# Altium project wacky-racer-hat.PrjPcb
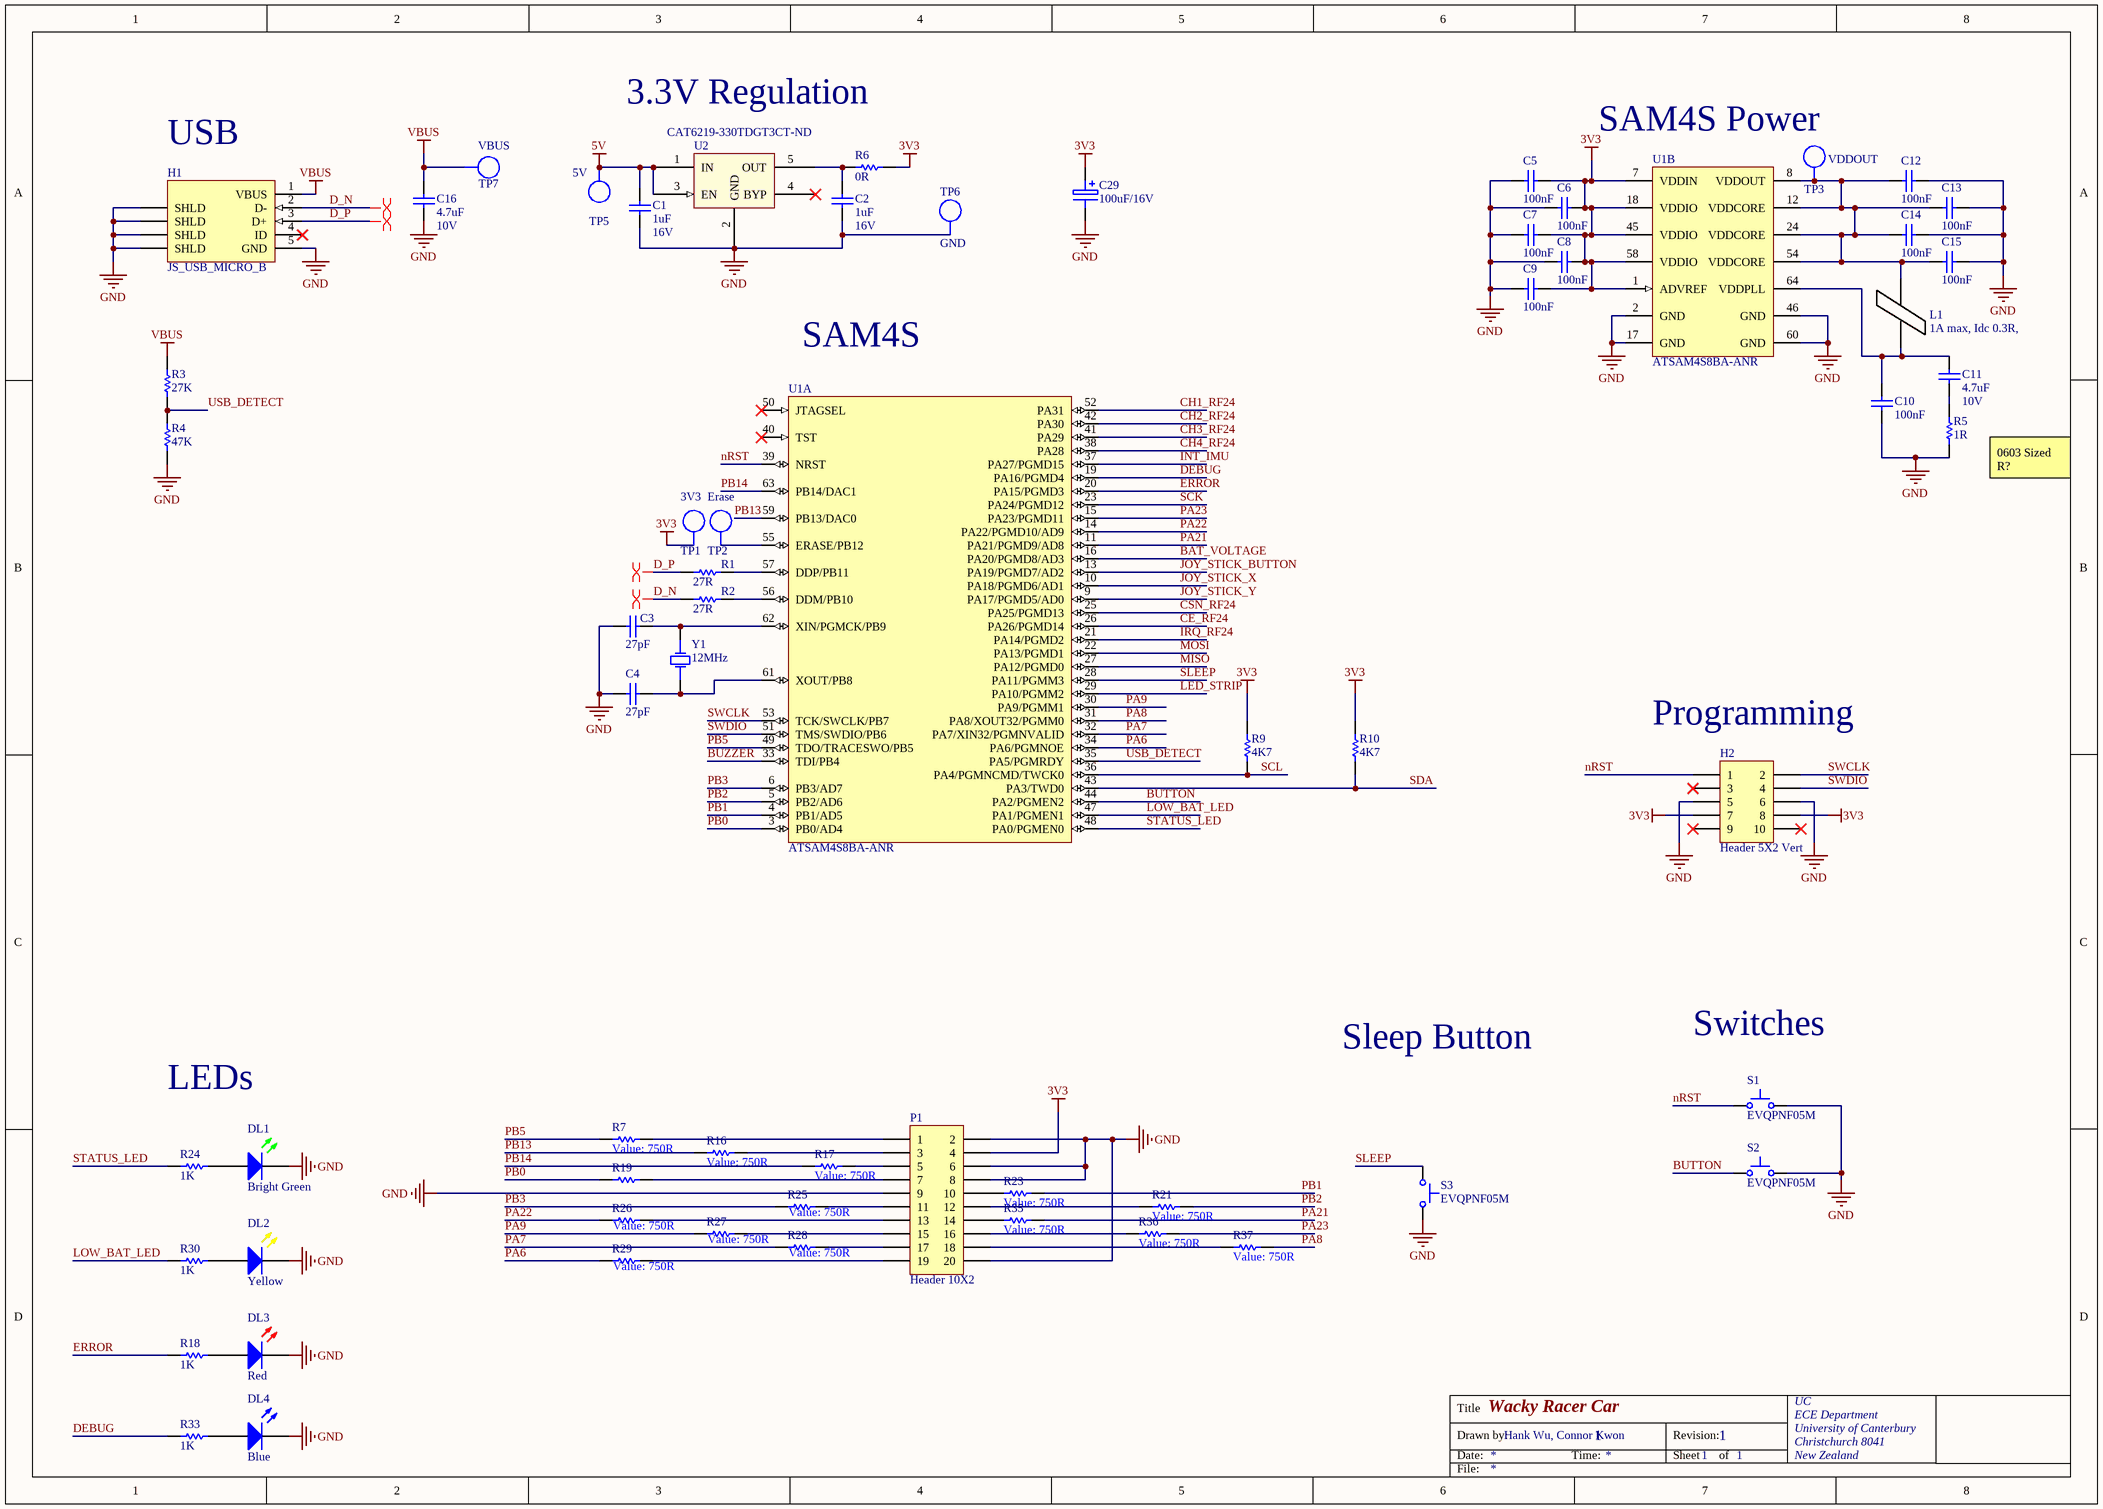
[diagram p0: MCU.SchDoc]
6 sheets, 109 parts. Net scope: global (net labels, ports and power ports of the same name join across sheets).
Board file: hat_template 2021V3.PcbDoc
Sheets:
  MCU.SchDoc
  Power.SchDoc
  IMU.SchDoc
  Radio.SchDoc
  buzzer.SchDoc
  joystick.SchDoc

## Sheet MCU.SchDoc: Wacky Racer Car
size A3; DrawnBy: Hank Wu, Connor Kwon; Organization: UC; Address1: ECE Department; Address2: University of Canterbury; Address3: Christchurch 8041; Address4: New Zealand; DocumentNumber: 1; Revision: 1; SheetNumber: 1; SheetTotal: 1

### Parts
C1  Max Voltage: 16V  [CAPC1608L]  (hidden comment: 1uF)
C2  Max Voltage: 16V  [CAPC1608L]  (hidden comment: 1uF)
C3  27pF  [CAPC1608L]
C4  27pF  [CAPC1608L]
C5  100nF  [CAPC1608L]
C6  100nF  [CAPC1608L]
C7  100nF  [CAPC1608L]
C8  100nF  [CAPC1608L]
C9  100nF  [CAPC1608L]
C10  100nF  [CAPC1608L]
C11  Max Voltage: 10V  [CAPC1608N]  (hidden comment: 4.7uF)
C12  100nF  [CAPC1608L]
C13  100nF  [CAPC1608L]
C14  100nF  [CAPC1608L]
C15  100nF  [CAPC1608L]
C16  Max Voltage: 10V  [CAPC1608N]  (hidden comment: 4.7uF)
C29  100uF/16V  [NICH-1]
DL1  Bright Green  [WL-SMCW0603]
DL2  Yellow  [WL-SMCW0603]
DL3  Red  [WL-SMCW0603]
DL4  Blue  [WL-SMCW0603]
H1  JS_USB_MICRO_B  [FCI_USB_10118194-0001LF]
H2  Header 5X2 Vert  [IDC2.54-V10D]
L1  1A max, Idc 0.3R,  [INDC3216L]
P1  Header 10X2  [HDR2X10]
R1  27R  [RESC1608L]
R2  27R  [RESC1608L]
R3  27K  [RESC1608L]
R4  47K  [RESC1608L]
R5  1R  [RESC3216L]
R6  0R  [RESC1608L]
R7  750R  [RESC1608L]
R9  4K7  [RESC1608L]
R10  4K7  [RESC1608L]
R16  750R  [RESC1608L]
R17  750R  [RESC1608L]
R18  1K  [RESC1608L]
R19  (no value)  [RESC1608L]
R21  750R  [RESC1608L]
R23  750R  [RESC1608L]
R24  1K  [RESC1608L]
R25  750R  [RESC1608L]
R26  750R  [RESC1608L]
R27  750R  [RESC1608L]
R28  750R  [RESC1608L]
R29  750R  [RESC1608L]
R30  1K  [RESC1608L]
R33  1K  [RESC1608L]
R35  750R  [RESC1608L]
R36  750R  [RESC1608L]
R37  750R  [RESC1608L]
S1  EVQPNF05M  [EVQPNF05M]
S2  EVQPNF05M  [EVQPNF05M]
S3  EVQPNF05M  [EVQPNF05M]
TP1  3V3  [TP_1206]  (no BOM)
TP2  Erase  [TP_1206]  (no BOM)
TP3  VDDOUT  [TP_1206]  (no BOM)
TP5  5V  [TP_1206]  (no BOM)
TP6  GND  [TP_1206]  (no BOM)
TP7  VBUS  [TP_1206]  (no BOM)
U1  ATSAM4S8BA-ANR  [LQFP64_L]  (parts A,B of 2)
U2  Supplier Part Number: CAT6219-330TDGT3CT-ND  [SOT95P280X145-5N]  (hidden comment: CAT6219-330TDGT3)
Y1  12MHz  [6.0X3.5-4]

### Nets
3V3: C5.2 C6.2 C7.2 C8.2 C9.2 C29.2 H2.7 H2.8 P1.4 R6.2 R9.2 R10.2 TP1.1 U1.1(ADVREF) U1.7(VDDIN) U1.18(VDDIO) U1.45(VDDIO) U1.58(VDDIO)
5V: C1.2 TP5.1 U2.1(IN) U2.3(EN)
GND: C1.1 C2.1 C3.1 C4.1 C5.1 C6.1 C7.1 C8.1 C9.1 C10.1 C12.2 C13.2 C14.2 C15.2 C16.1 C29.1 DL1.1(K) DL2.1(K) DL3.1(K) DL4.1(K) H1.5(GND) H1.6(SHLD) H2.5 H2.6 P1.2 P1.6 P1.8 P1.9 P1.20 R4.1 R5.1 S1.2 S2.2 S3.2 TP6.1 U1.2(GND) U1.17(GND) U1.46(GND) U1.60(GND) U2.2(GND)
VBUS: C16.2 H1.1(VBUS) R3.2 TP7.1
BAT_VOLTAGE: U1.16(PA20/PGMD8/AD3)
BUTTON: S2.1 U1.44(PA2/PGMEN2)
BUZZER: U1.33(TDI/PB4)
CE_RF24: U1.26(PA26/PGMD14)
CH1_RF24: U1.52(PA31)
CH2_RF24: U1.42(PA30)
CH3_RF24: U1.41(PA29)
CH4_RF24: U1.38(PA28)
CSN_RF24: U1.25(PA25/PGMD13)
D_N: H1.2(D-) R2.1
D_P: H1.3(D+) R1.1
DEBUG: R33.1 U1.19(PA16/PGMD4)
ERROR: R18.1 U1.20(PA15/PGMD3)
INT_IMU: U1.37(PA27/PGMD15)
IRQ_RF24: U1.21(PA14/PGMD2)
JOY_STICK_BUTTON: U1.13(PA19/PGMD7/AD2)
JOY_STICK_X: U1.10(PA18/PGMD6/AD1)
JOY_STICK_Y: U1.9(PA17/PGMD5/AD0)
LED_STRIP: U1.29(PA10/PGMM2)
LOW_BAT_LED: R30.1 U1.47(PA1/PGMEN1)
MISO: U1.27(PA12/PGMD0)
MOSI: U1.22(PA13/PGMD1)
nRST: H2.1 S1.1 U1.39(NRST)
PA6: R29.1 U1.34(PA6/PGMNOE)
PA7: R28.1 U1.32(PA7/XIN32/PGMNVALID)
PA8: R37.2 U1.31(PA8/XOUT32/PGMM0)
PA9: R27.1 U1.30(PA9/PGMM1)
PA21: R35.2 U1.11(PA21/PGMD9/AD8)
PA22: R26.1 U1.14(PA22/PGMD10/AD9)
PA23: R36.2 U1.15(PA23/PGMD11)
PB0: R19.1 U1.3(PB0/AD4)
PB1: R23.2 U1.4(PB1/AD5)
PB2: R21.2 U1.5(PB2/AD6)
PB3: R25.1 U1.6(PB3/AD7)
PB5: R7.1 U1.49(TDO/TRACESWO/PB5)
PB13: R16.1 U1.59(PB13/DAC0)
PB14: R17.1 U1.63(PB14/DAC1)
SCK: U1.23(PA24/PGMD12)
SCL: R9.1 U1.36(PA4/PGMNCMD/TWCK0)
SDA: R10.1 U1.43(PA3/TWD0)
SLEEP: S3.1 U1.28(PA11/PGMM3)
STATUS_LED: R24.1 U1.48(PA0/PGMEN0)
SWCLK: H2.2 U1.53(TCK/SWCLK/PB7)
SWDIO: H2.4 U1.51(TMS/SWDIO/PB6)
USB_DETECT: R3.1 R4.2 U1.35(PA5/PGMRDY)
NetC2_2: C2.2 R6.1 U2.5(OUT)
NetC3_2: C3.2 U1.62(XIN/PGMCK/PB9) Y1.3(OSC2)
NetC4_2: C4.2 U1.61(XOUT/PB8) Y1.1(OSC1)
NetC10_2: C10.2 C11.2 L1.1 U1.64(VDDPLL)
NetC11_1: C11.1 R5.2
NetC12_1: C12.1 C13.1 C14.1 C15.1 L1.2 TP3.1 U1.8(VDDOUT) U1.12(VDDCORE) U1.24(VDDCORE) U1.54(VDDCORE)
NetDL1_2: DL1.2(A) R24.2
NetDL2_2: DL2.2(A) R30.2
NetDL3_2: DL3.2(A) R18.2
NetDL4_2: DL4.2(A) R33.2
NetP1_1: P1.1 R7.2
NetP1_3: P1.3 R16.2
NetP1_5: P1.5 R17.2
NetP1_7: P1.7 R19.2
NetP1_10: P1.10 R23.1
NetP1_11: P1.11 R25.2
NetP1_12: P1.12 R21.1
NetP1_13: P1.13 R26.2
NetP1_14: P1.14 R35.1
NetP1_15: P1.15 R27.2
NetP1_16: P1.16 R36.1
NetP1_17: P1.17 R28.2
NetP1_18: P1.18 R37.1
NetP1_19: P1.19 R29.2
NetR1_2: R1.2 U1.57(DDP/PB11)
NetR2_2: R2.2 U1.56(DDM/PB10)
NetTP2_1: TP2.1 U1.55(ERASE/PB12)

Not connected (* = marked no-connect by the designer): H1 4(ID)*; H2 3* 9* 10*; U1 40(TST)* 50(JTAGSEL)*; U2 4(BYP)*

### Layout directives
differential pair: D_N, D_P

### Notes on the sheet
- 3.3V Regulation
- (near H1) USB
- SAM4S Power
- SAM4S
- (near R5) 0603 Sized R?
- (near H2) Programming
- Sleep Button
- Switches
- LEDs
- Title
- Drawn by:
- Date:
- Time:
- Revision:
- Sheet
- of
- File:

### Library data of the parts
C1 C2 = CC_1uF_0603: CAP CER 1uF Y5V -20% +80% 16V 0603; PackageReference: 0603; Code_IPC: 1608 [0603]; Verify: *; Supplier: ECE Dept; Storage Location: PCB Assembly WS; Value: 1uF
C3 C4 = CC_27pF_0603: CAP CER 27pF NPO/COG +-5% 50V 0603; PackageReference: 0603; Code_IPC: 1608 [0603]; Verify: *; Supplier: ECE Dept; Storage Location: PCB Assembly WS; Value: 27pF
C5-C10 C12-C15 = CC_100nF_0603: CAP CER 100nF X7R +-10% 50V 0603; PackageReference: 0603; Code_IPC: 1608 [0603]; Verify: *; Supplier: ECE Dept; Storage Location: PCB Assembly WS; Value: 100nF
C11 C16 = CC_4.7uF_0603: CAP CER 4.7uF X5R +-20%  10V 0603; Note: Footprint corresponds to dimensions for bulk cassette packaging. This case size has tightened tolerances.; PackageReference: 0805; Code_IPC: 2012[0805]; Verify: *; Supplier: ECE Dept; Storage Location: PCB Assembly WS; Value: 4.7uF
C29 = CA_100uF_16V: CAP ALUM 100uF 16V SMD; Manufacturer PN: UWX1C101MCL1GB; Manufacturer: Nichcon; Supplier 1: Farnell; Supplier Part Number 1: 1870677; Storage Location: PCB Assembly WS; Supplier: ECE Dept; Supplier 2: Digi-Key; Supplier Part Number 2: 493-2105-1-ND; Value: 100uF/16V
DL1 = DL_150060VS75000: LED Bright Green 40mcd 0603 SMD; Manufacturer: WURTH ELEKTRONIK; Forward Current If: 30; Forward Voltage: 2; Viewing Angle: 140°; Wavelength Typ: 570; Luminous Intensity: 40; LED Mounting: SMD; Supplier 1: Farnell; Supplier Part Number 1: 2322073; Manufacturer Part Number: 150060VS75000; Storage Location: PCB Assembly WS; Supplier: ECE Dept; LED Colour: Bright Green
DL2 = DL_150060YS75000: LED Yellow 120mcd 0603 SMD; Manufacturer: WURTH ELEKTRONIK; Forward Current If: 30; Forward Voltage: 2; Wavelength Typ: 590; Lens Shape: Rectangular; Viewing Angle: 140°; Luminous Intensity: 120; LED Mounting: SMD; Supplier 1: Farnell; Supplier Part Number 1: 2322074; Manufacturer Part Number: 150060YS75000; Storage Location: PCB Assembly WS; Supplier: ECE Dept; LED Colour: Yellow
DL3 = DL_150060RS75000: LED Red 250mcd 0603 SMD; Manufacturer: WURTH ELEKTRONIK; Forward Current If: 30; Forward Voltage: 2; Lens Shape: Rectangular; Luminous Intensity: 250; Wavelength Typ: 625; Viewing Angle: 140°; LED Mounting: SMD; Supplier 1: Farnell; Supplier Part Number 1: 2322071; Manufacturer Part Number: 150060RS75000; Storage Location: PCB Assembly WS; Supplier: ECE Dept; LED Colour: Red
DL4 = DL_150060BS75000: LED Blue 270mcd 0603 SMD; Manufacturer: WURTH ELEKTRONIK; Forward Current If: 30; Forward Voltage: 3.2; Luminous Intensity: 270; Viewing Angle: 120°; Wavelength Typ: 470; Pricing: 1=0.3844, 50=0.3252, 100=0.2957, 500=0.2365 (NZD); Supplier 1: Farnell; Supplier Part Number 1: 2322069; Manufacturer Part Number: 150060BS75000; Storage Location: PCB Assembly WS; Supplier: ECE Dept; LED Colour: Blue
H1 = JS_USB_MICRO_B_SMT: CONN USB MICRO B RECPT SMT R/A; Manufacturer: FCI; Manufacturer Part Number: 10118194-0001LF; Gender: Receptacle; Number of Contacts: 5; Specifications: USB 2.0; Supplier 1: Digi-Key; Supplier Part Number 1: 609-4618-1-ND; Features: Shielded, Solder Retention; Mounting Type: Surface Mount, Right Angle, Horizontal
H2 = JA_HDR_IDC_5X2_VERT: IDC Header, 2,54mm, 10-Pin, Vert; Supplier: ECE Dept; Supplier 1: Farnell; Supplier Part Number 1: 1096985; Storage Location: ECE Dept Store
L1 = IN_Ferrite-Bead: Ferrite Bead, Rdc 0.3R, Z100MHZ 600R, Imax 1A, SMD 1206; Manufacturer: FAIR-RITE; Manufacturer PN: 2512066017Y1; DC Current Rating: 1; DC Resistance Max: 0.08; Ferrite Case Style: 1206 ^3216 Metric]; Frequency Range: 50MHz to 1; Impedance: 600; Impedance Tolerance: ± 25%; Supplier: ECE Dept; Storage Location: PCB Assembly WS; Ferrite Mounting: SMD; Supplier 1: Farnell; Supplier Part Number 1: 1612060; Manufacturer Part Number: 2512066017Y1; Value: 1A max, Idc 0.3R,
P1 = Header 10X2: Header, 10-Pin, Dual row; LatestRevisionDate: 17-Jul-2002; LatestRevisionNote: Re-released for DXP Platform.; Publisher: Altium Limited
R1 R2 = RS_27R: RES 27 OHM 1/10W 5% 0603 SMD; Storage Location: PCB Assembly WS; Supplier: ECE Dept; Value: 27R
R3 R4 = RS_27K: RES 27K OHM 1/10W 5% 0603 SMD; Storage Location: PCB Assembly WS; Supplier: ECE Dept
  R3: Value: 27K
  R4: Value: 47K
R5 = RT_1R: RES 1R OHM 1/4W 5% 1206 SMD; Storage Location: PCB Assembly WS; Supplier: ECE Dept; Value: 1R
R6 = RS_0R0: RES 0.0 OHM 1/10W 5% 0603 SMD; Storage Location: PCB Assembly WS; Supplier: ECE Dept; Value: 0R
R7 R16 R17 R19 R21 R23 R25-R29 R35-R37 = RS_750R: RES 750 OHM 1/10W 5% 0603 SMD; Storage Location: PCB Assembly WS; Supplier: ECE Dept
  R7 R16 R17 R21 R23 R25-R29 R35-R37: Value: 750R
R9 R10 = RS_4K7: RES 4.7K OHM 1/10W 5% 0603 SMD; Storage Location: PCB Assembly WS; Supplier: ECE Dept; Value: 4K7
R18 R24 R30 R33 = RS_1K: RES 1.0K OHM 1/10W 5% 0603 SMD; Storage Location: PCB Assembly WS; Supplier: ECE Dept; Value: 1K
S1-S3 = WS_EVQPNF05M: Panasonic 6 x 3.5mm SMD Light Touch Switch Type SMD; PackageDescription: 6.0 x 3.5 mm; Supplier 1: Farnell; Supplier Part Number 1: 2079481; Manufacturer: Panasonic; Manufacturer PN: EVQPNF05M; Supplier 2: Digi-Key; Supplier Part Number 2: P13598SCT-ND; Storage Location: PCB Assembly WS; Supplier: ECE Dept
TP1-TP3 TP5-TP7 = TP_1206: Test-Point 3.3x1.6x2.1mm SMD; Manufacturer: Harwin Inc; Manufacturer Part Number: S1751-46R; Value: TP; Manufacturer PN: *; Storage Location: ProtoPlace; Mounting Type: Surface Mount; Type: PC Test Point; Supplier 1: Digi-Key; Supplier Part Number 1: 952-1478-2-ND; Supplier 2: Farnell; Supplier Part Number 2: 1826282; Supplier: ECE Dept
U1 = SE_ATSAM4S16BA-MU: IC MCU 32BIT 512KB FLASH 64LQFP; Manufacturer: Atmel; Connectivity: I²C, IrDA, Memory Card, SPI, SSC, UART/USART, USB; Core Processor: ARM® Cortex®-M4; Core Size: 32-Bit; Data Converters: A/D 11x12b, D/A 2x12b; Number of I/O: 47; Peripherals: Brown-out Detect/Reset, DMA, POR, PWM, WDT; Program Memory Size: 512KB (512K x 8); RAM Size: 128K x 8; Speed: 120MHz; Voltage - Supply (Vcc/Vdd): 1.62 V ~ 3.6 V; PackageVersion: revJ, Jul-2007; PackageReference: 64PS; PackageDescription: 64-Pin Quad Flat No-Lead (QFN) Sawn, 9 x 9 x 1.0 mm Body, 0.5 mm Pitch, Exposed Pad; Code_JEDEC: MO-220VMMD-3; ComponentLink1Description: Manufacturer URL; ComponentLink1URL: http://www.atmel.com/; ComponentLink2Description: SAM4S Series Datasheet; ComponentLink2URL: http://www.atmel.com/dyn/resources/prod_documents/11100.pdf; ComponentLink3Description: SAM4S Series Summary; ComponentLink3URL: http://www.atmel.com/dyn/resources/prod_documents/11100S.pdf; Supplier 1: Digi-Key; Package / Case: 64-LQFP; Packaging: Cut Tape (CT); Program Memory Type: FLASH; Supplier Part Number 1: ATSAM4S8BA-ANRCT-ND; Manufacturer Part Number: ATSAM4S8BA-ANR
U2 = SV_CAT6219-330TDGT3: IC REG LIN 3.3V 500MA TSOT23-5; Voltage - Input (Max): 5.5V; Voltage Dropout (Max): 0.5V @ 500mA; Manufacturer Part Number: CAT6219-330TDGT3; Base Part Number: CAT6219; Current - Output: 500mA; Package / Case: SOT-23-5 Thin, TSOT-23-5; Supplier: Digi-Key; Supplier Device Package: TSOT-23-5; Voltage - Output (Min/Fixed): 3.3V; ComponentLink1URL: http://www.onsemi.com/pub/Collateral/CAT6219-D.PDF; ComponentLink1Description: http://www.onsemi.com/pub/Collateral/CAT6219-D.PDF; Supplier 1: Digi-Key
Y1 = XT_CRYSTAL_12MHz_18pF: CRYSTAL 12MHZ 18PF 6X3.5mm SMD; Manufacturer: CTS-Frequency Controls; Manufacturer Part Number: 406C35D12M00000; ESR (Equivalent Series Resistance): 60 Ohm; Frequency Stability: ±50ppm; Frequency Tolerance: ±30ppm; Operating Mode: Fundamental; Supplier 1: Digi-Key; Height: 0.047" (1.20mm); Load Capacitance: 18pF; Mounting Type: Surface Mount; Operating Temperature: -20°C ~ 70°C; Package / Case: 4-SMD, No Lead (DFN, LCC); Size / Dimension: 0.236" L x 0.138" W (6.00mm x 3.50mm); Supplier Part Number 1: CTX855CT-ND; Frequency: 12MHz

## Sheet Power.SchDoc: Power
size A3; DrawnBy: Hank Wu, Connor Kwon; Address1: ECE Department; Address2: University of Canterbury; Address3: Christchurch 8041; Address4: New Zealand; Revision: 1
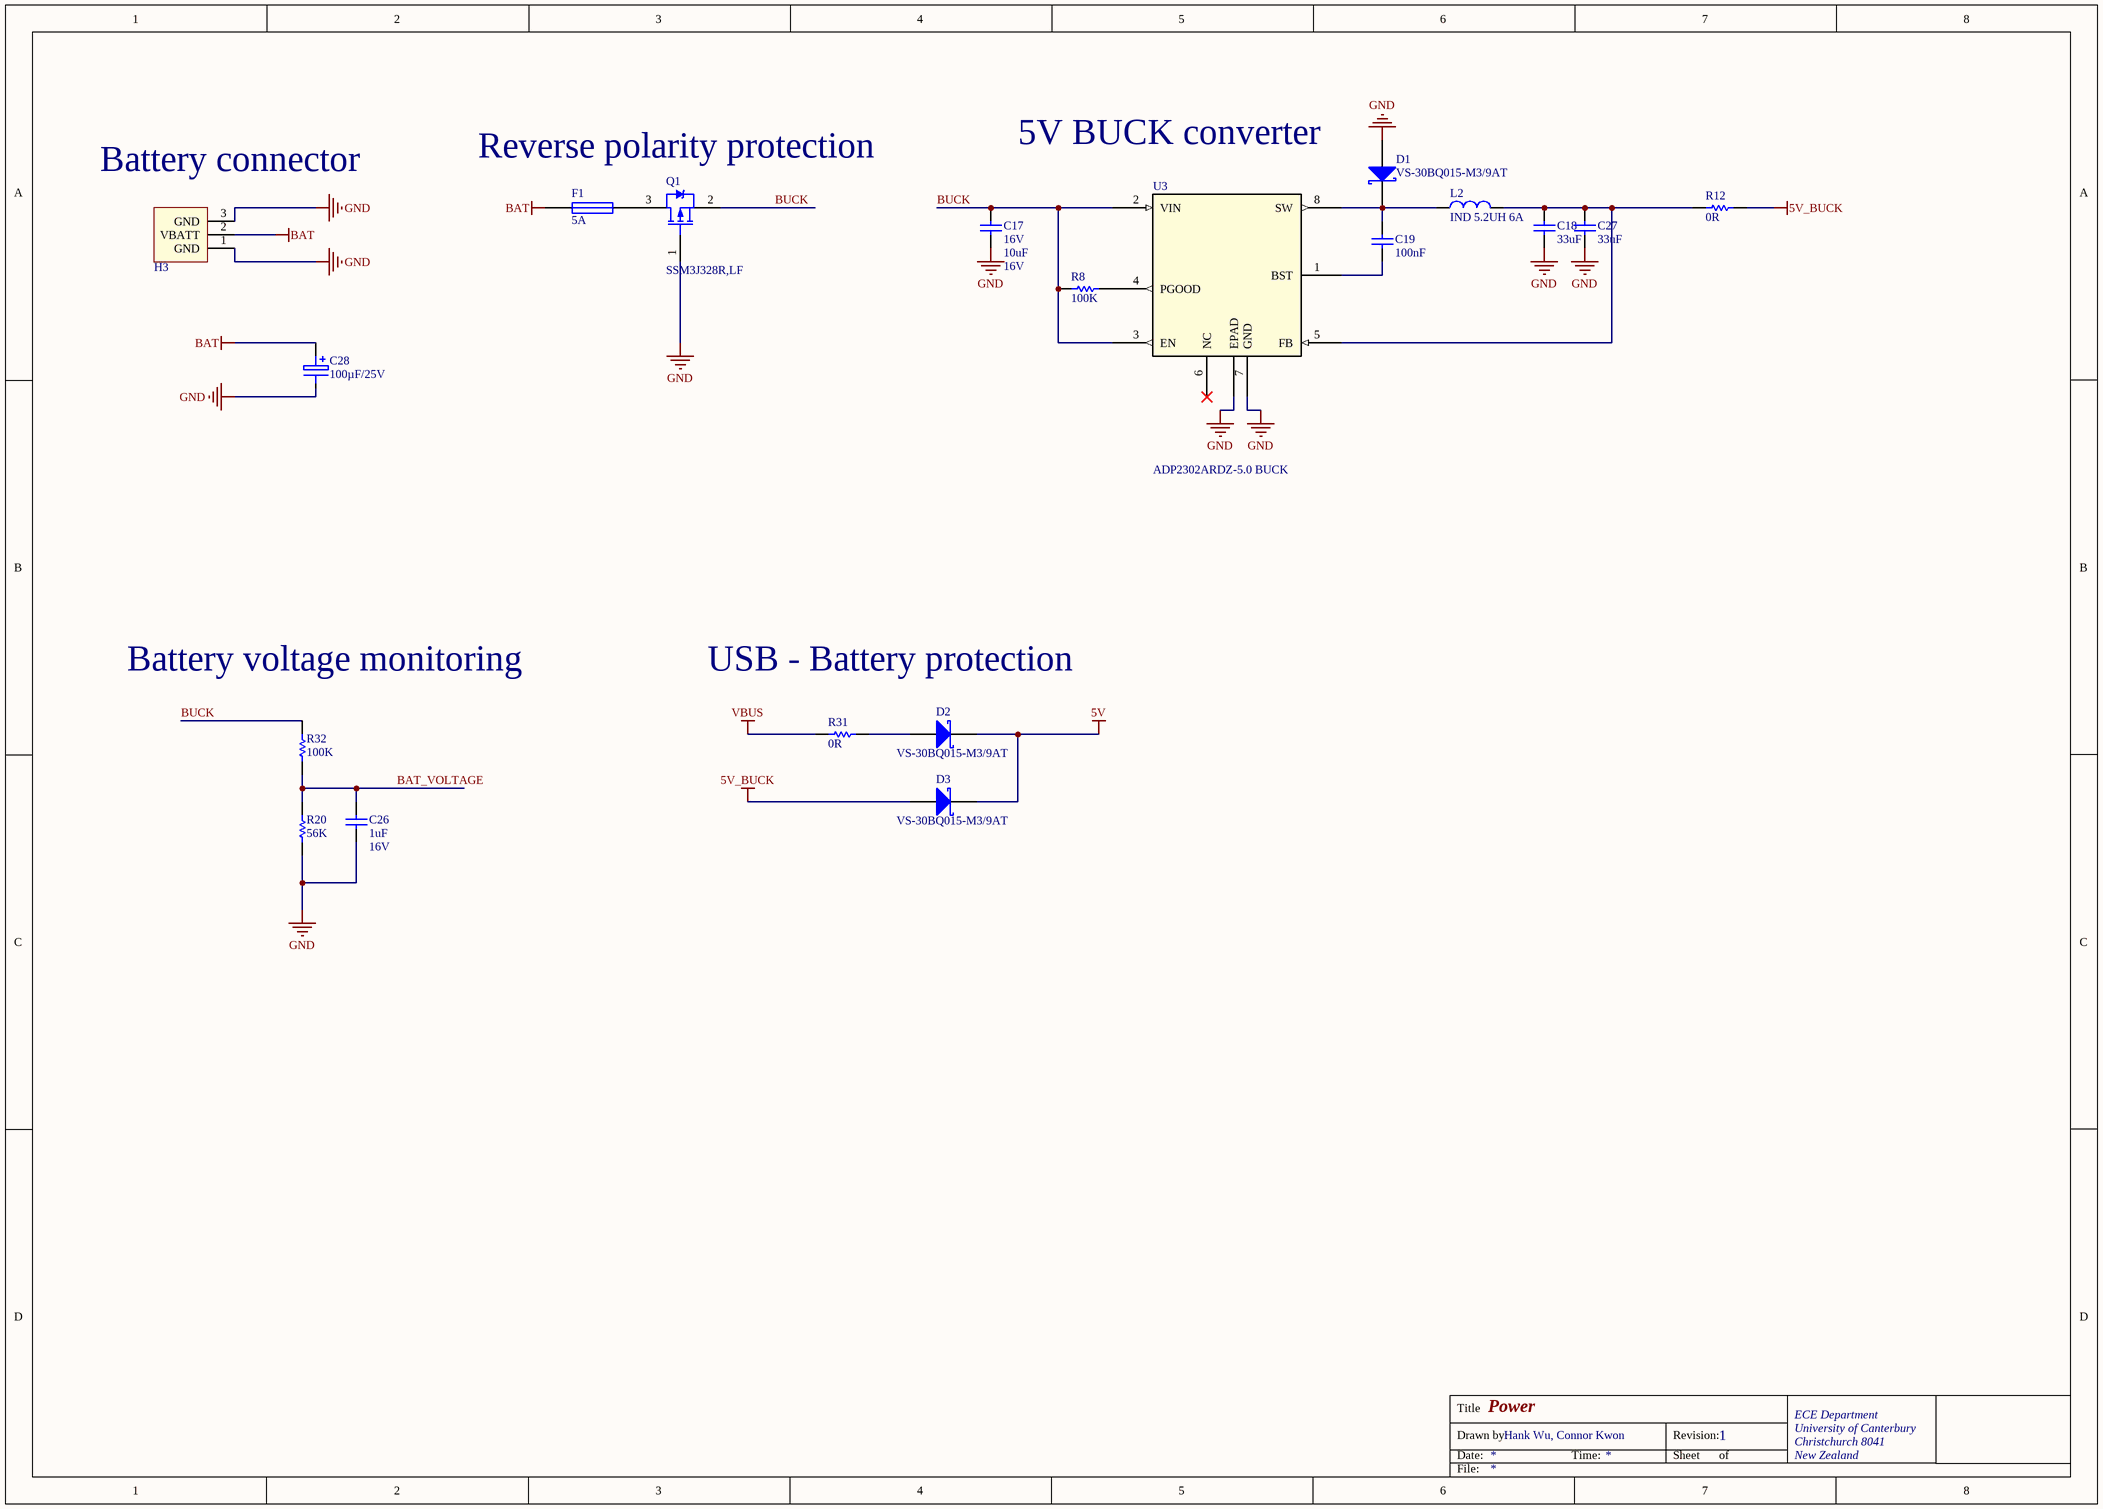
[diagram p1: Power.SchDoc]

### Parts
C17  Voltage - Rated: 16V  [CAPC2012L]  (hidden comment: 10uF)
C18  33uF  [CAPC2012L]
C19  100nF  [CAPC1608L]
C26  Max Voltage: 16V  [CAPC1608L]  (hidden comment: 1uF)
C27  33uF  [CAPC2012L]
C28  100µF/25V  [CAPAE6666X77M]
D1  VS-30BQ015-M3/9AT  [SMC]
D2  VS-30BQ015-M3/9AT  [SMC]
D3  VS-30BQ015-M3/9AT  [SMC]
F1  5A  [RESC3216N]
H3  Battery_HEADER_3pin  [BATT_HEADER_3POS]  (value not drawn)
L2  IND 5.2UH 6A  [INDUCTOR5u2]
Q1  SSM3J328R,LF  [SOT23_L]
R8  100K  [RESC1608L]
R12  0R  [RESC1608L]
R20  56K  [RESC1608L]
R31  0R  [RESC1608L]
R32  100K  [RESC1608L]
U3  ADP2302ARDZ-5.0 BUCK  [RD_8_1]

### Nets
5V: D2.2(K) D3.2(K)
5V_BUCK: D3.1(A) R12.2
BAT: C28.2 F1.1 H3.2(VBATT)
GND: C17.1 C18.1 C26.1 C27.1 C28.1 D1.1(A) H3.1(GND) H3.3(GND) Q1.1 R20.1 U3.7(GND) U3.EPAD
VBUS: R31.1
BAT_VOLTAGE: C26.2 R20.2 R32.1
BUCK: C17.2 Q1.2 R8.1 R32.2 U3.2(VIN) U3.3(EN)
NetC18_2: C18.2 C27.2 L2.2 R12.1 U3.5(FB)
NetC19_1: C19.1 U3.1(BST)
NetC19_2: C19.2 D1.2(K) L2.1 U3.8(SW)
NetD2_1: D2.1(A) R31.2
NetF1_2: F1.2 Q1.3
NetR8_2: R8.2 U3.4(PGOOD)

Not connected (* = marked no-connect by the designer): U3 6(NC)*

### Notes on the sheet
- (near H3) Battery connector
- Reverse polarity protection
- 5V BUCK converter
- Battery voltage monitoring
- USB - Battery protection
- Title
- Drawn by:
- Date:
- Time:
- Revision:
- Sheet
- of
- File:

### Library data of the parts
C17 = CC_10uF_16V_0805: CAP CER 10uF X5R 16V 0805; Manufacturer: Samsung Electro-Mechanics; Manufacturer Part Number: CL21A106KOQNNWE; Note: Footprint corresponds to dimensions for bulk cassette packaging. This case size has tightened tolerances.; Tolerance: ±10%; Notification: Current market demand for these product types have resulted in fluctuating and extending lead times. Lead times may differ.; PackageReference: 0805; Code_IPC: 2012[0805]; Supplier 1: Digi-Key; RoHS: RoHS Compliant; Category: Capacitors; Stock 1: 20000; Pricing 1: 1=0.35, 10=0.25, 100=0.1178, 500=0.08254, 1000=0.06831 (NZD); Packaging: Cut Tape (CT); Part Status: Active; Temperature Coefficient: X5R; Operating Temperature: -55°C ~ 85°C; Features: -; Ratings: -; Applications: General Purpose; Mounting Type: Surface Mount, MLCC; Package / Case: 0805 (2012 Metric); Size / Dimension: 0.079" L x 0.049" W (2.00mm x 1.25mm); Height - Seated (Max): -; Thickness (Max): 0.055" (1.40mm); Lead Spacing: -; Lead Style: -; ComponentLink1URL: http://www.samsungsem.com/kr/support/product-search/mlcc/CL21A106KOQNNWE.jsp; ComponentLink1Description: http://www.samsungsem.com/kr/support/product-search/mlcc/CL21A106KOQNNWE.jsp; Supplier Part Number 1: 1276-2894-1-ND; Value: 10uF; Max Voltage: 16V
C18 C27 = CC_33uF_6V3_0805: CAP CER 33uF X5R 6V3 0805; Manufacturer: TDK Corporation; Manufacturer Part Number: C2012X5R0J336M125AC; Tolerance: ±20%; Voltage - Rated: 6.3V; Notification: Current market demand for these product types have resulted in fluctuating and extending lead times. Lead times may differ.; Supplier 1: Digi-Key; RoHS: RoHS Compliant; Category: Capacitors; Stock 1: 20000; Pricing 1: 1=1.65, 10=1.262, 100=0.9023, 500=0.6985, 1000=0.60149 (NZD); Packaging: Cut Tape (CT); Part Status: Active; Temperature Coefficient: X5R; Operating Temperature: -55°C ~ 85°C; Features: Low ESL; Ratings: -; Applications: General Purpose; Failure Rate: -; Mounting Type: Surface Mount, MLCC; Package / Case: 0805 (2012 Metric); Size / Dimension: 0.079" L x 0.049" W (2.00mm x 1.25mm); Height - Seated (Max): -; Thickness (Max): 0.057" (1.45mm); Lead Spacing: -; Lead Style: -; ComponentLink1URL: https://product.tdk.com/info/en/catalog/datasheets/mlcc_commercial_general_en.pdf; ComponentLink1Description: https://product.tdk.com/info/en/catalog/datasheets/mlcc_commercial_general_en.pdf; Supplier Part Number 1: 445-5986-1-ND; Value: 33uF
C19 = CC_100nF_0603: CAP CER 100nF X7R +-10% 50V 0603; PackageReference: 0603; Code_IPC: 1608 [0603]; Verify: *; Supplier: ECE Dept; Storage Location: PCB Assembly WS; Value: 100nF
C26 = CC_1uF_0603: CAP CER 1uF Y5V -20% +80% 16V 0603; PackageReference: 0603; Code_IPC: 1608 [0603]; Verify: *; Supplier: ECE Dept; Storage Location: PCB Assembly WS; Value: 1uF
C28 = CA_100uF_25V: CAP ALUM 100UF 25V 20% SMD; Manufacturer: Nichicon; Manufacturer Part Number: UWT1E101MCL1GS; Ripple Current: 91mA; Supplier 1: Digi-Key; Height - Seated (Max): 0.303" (7.70mm); Mounting Type: Surface Mount; Operating Temperature: -55°C ~ 105°C; Package / Case: Radial, Can - SMD; Size / Dimension: 0.248" Dia (6.30mm); Supplier Part Number 1: 493-2190-1-ND; Capacitance: 100µF/25V
D1-D3 = DS_VS-30BQ015-M3: DIODE, SCHOTTKY, 3A, 15V, DO-214AB / SMC; Manufacturer: Vishay Semiconductors; Forward Voltage: 350mV; Max Forward Surge Current (Ifsm): 650A; Peak Reverse Current: 4mA; Average Rectified Current: 3A; Max Reverse Voltage (DC): 15V; Supplier: Digi-Key; ComponentLink1URL: https://datasheet.ciiva.com/36181/vs-30bq015-m3-9at-36181258.pdf; ComponentLink1Description: https://datasheet.ciiva.com/36181/vs-30bq015-m3-9at-36181258.pdf; Supplier 1: Digi-Key; Supplier 2: Element14; Supplier Part Number 1: VS-30BQ015-M3/9ATGIDKR-ND; Supplier Part Number 2: 2628288; Supplier Part Number: VS-30BQ015-M3/9AT-ND; Manufacturer Part Number: VS-30BQ015-M3/9AT
F1 = FS_Fuse_5.0A: Fuse 5.0A Fast Acting 1206 SMD; Manufacturer Part Number: C1F5; Manufacturer: Bel TRP; Voltage Rating (AC): 125V; Voltage Rating (DC): 63V; DC Cold Resistance: 19mR; Fuse Type: Board Mount (Cartridge Style Excluded); Approvals: CE,cURus; Mount: Surface Mount; Case/Package: 1206; Number of Pins: 2; Case Code (Metric): 3216; Case Code (Imperial): 1206; Contact Plating: Nickel,Tin; Min Operating Temperature: -55°C; Max Operating Temperature: 125°C; Packaging: Tape and Reel; Voltage Rating: 125V; Length: 0.126inch; Width: 0.062inch; Supplier 1: Digi-Key; Stock 1: 725; Pricing 1: 1=0.32, 5=0.312, 10=0.298, 50=0.2662, 100=0.2479, 250=0.22032, 500=0.1836, 1000=0.17442 (USD); ComponentLink1URL: http://www.farnell.com/datasheets/2571625.pdf; ComponentLink1Description: http://www.farnell.com/datasheets/2571625.pdf; ComponentLink2URL: http://belfuse.com/pdfs/C1F.pdf; ComponentLink2Description: http://belfuse.com/pdfs/C1F.pdf; ComponentLink3URL: http://www.mouser.com/ds/2/643/C1F-594910.pdf; ComponentLink3Description: http://www.mouser.com/ds/2/643/C1F-594910.pdf; ComponentLink4URL: https://belfuse.com/resources/StewartConnector/C1F.pdf; ComponentLink4Description: https://belfuse.com/resources/StewartConnector/C1F.pdf; Current Rating: 5A; Supplier Part Number 1: 507-1886-1-ND; Supplier 2: Element14; Supplier Part Number 2: 2848595; Value: 5A
H3 = Battery_HEADER_3pin: 3Pin Header 2.54mm spacing
L2 = CDRH104RNP-5R2NC: FIXED IND 5.2UH 6A 22 MOHM SMD; Manufacturer: Sumida America Components Inc.; Material - Core: Ferrite; Tolerance: ±30%; Current - Saturation: 5.6A; Shielding: Shielded; DC Resistance (DCR): 22 mOhm Max; Supplier 1: Digi-Key; Manufacturer Part Number: CDRH104RNP-5R2NC; RoHS: RoHS Compliant; Category: Inductors, Coils, Chokes; Stock 1: 3849; Pricing 1: 1=2.9, 10=2.678, 100=1.8743, 500=1.5173 (NZD); Packaging: Cut Tape (CT); Part Status: Active; Type: -; Q @ Freq: -; Frequency - Self Resonant: -; Ratings: -; Operating Temperature: -40°C ~ 100°C; Mounting Type: Surface Mount; Package / Case: Nonstandard; Supplier Device Package: -; Size / Dimension: 0.402" L x 0.394" W (10.20mm x 10.00mm); Height - Seated (Max): 0.157" (4.00mm); ComponentLink1URL: http://products.sumida.com/products/pdf/CDRH104R.pdf; ComponentLink1Description: http://products.sumida.com/products/pdf/CDRH104R.pdf; Supplier Part Number 1: 308-2280-1-ND
Q1 = TM_SSM3J328R: MOSFET P-CH 20V 6A SOT23-3; Manufacturer: Toshiba; FET Feature: Logic Level Gate, 1.5V Drive; FET Type: MOSFET P-Channel, Metal Oxide; Gate Charge (Qg) @ Vgs: 12.8nC @ 4.5V; Input Capacitance (Ciss) @ Vds: 840pF @ 10V; Power - Max: 1W; Rds On Max: 29.8mR; Drain to Source Resistance: 47.4mR; Turn-On Delay Time: 32ns; Power Dissipation: 2W; Number of Channels: 1; Turn-Off Delay Time: 107ns; Gate to Source Voltage (Vgs): 8V; Input Capacitance: 840pF; Element Configuration: Single; Drain to Source Breakdown Voltage: -20V; Vgs(th) (Max) @ Id: 1V @ 1mA; Current - Continuous Drain (Id) @ 25° C: 6A; Drain to Source Voltage (Vdss): 20V; Package / Case: SOT-23-3 Flat Leads; Supplier Device Package: SOT-23F; Pricing: 1=0.79, 10=0.658, 25=0.5772, 100=0.4939, 250=0.42836, 500=0.36284, 1000=0.27972 (NZD); Storage Location: PCB Assembly WS; Supplier: Digi-Key; ComponentLink1URL: https://datasheet.ciiva.com/11158/ssm3j328r-datasheet-en-20140301-11158652.pdf; ComponentLink1Description: https://datasheet.ciiva.com/11158/ssm3j328r-datasheet-en-20140301-11158652.pdf; Supplier Part Number: SSM3J328RLFDKR-ND; Max Operating Temperature: 150°C; Mount: Surface Mount; Packaging: Tape and Reel; Min Operating Temperature: -55°C; Continuous Drain Current (ID): 6A; Radiation Hardening: No; Max Power Dissipation: 1W; Package Quantity: 3000; Case/Package: SOT-23-3; Number of Pins: 3; Number of Elements: 1; Supplier 1: Digi-Key; Supplier Part Number 1: SSM3J328RLFDKR-ND; Manufacturer Part Number: SSM3J328R,LF
R8 R32 = RS_100K: RES 100K OHM 1/10W 5% 0603 SMD; Storage Location: PCB Assembly WS; Supplier: ECE Dept; Value: 100K
R12 R31 = RS_0R0: RES 0.0 OHM 1/10W 5% 0603 SMD; Storage Location: PCB Assembly WS; Supplier: ECE Dept; Value: 0R
R20 = RS_56K: RES 56.0K OHM 1/10W 5% 0603 SMD; Storage Location: PCB Assembly WS; Supplier: ECE Dept; Value: 56K
U3 = ADP2302ARDZ-5.0-R7: IC REG BUCK 5V 2A 8SOIC; Vendor: Analog Devices Inc; Frequency - Switching: 700kHz; Output Type: Fixed; Voltage - Input (Max): 20V; Manufacturer_Part_Number: ADP2302ARDZ-5.0-R7; Type: DEV; Value: Value; Supplier 1: Digi-Key; Current - Output: 2A; Voltage - Output (Min/Fixed): 5V; Supplier Part Number 1: ADP2302ARDZ-5.0-R7CT-ND

## Sheet IMU.SchDoc: IMU
size A3; DrawnBy: Hank Wu, Connor Kwon; Address1: ECE Department; Address2: University of Canterbury; Address3: Christchurch 8041; Address4: New Zealand; Revision: 1
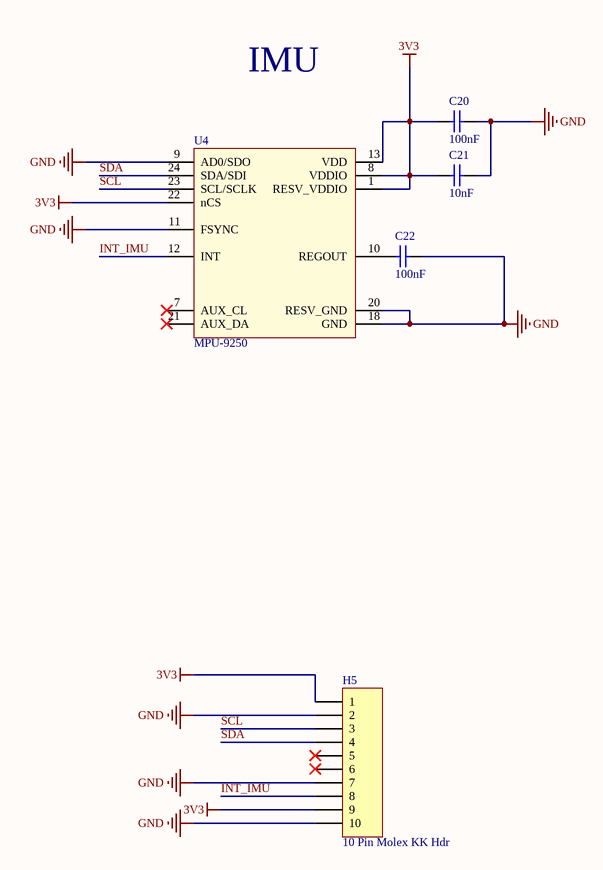
[diagram p2: IMU.SchDoc]

### Parts
C20  100nF  [CAPC1608L]
C21  10nF  [CAPC1608L]
C22  100nF  [CAPC1608L]
H5  10 Pin Molex KK Hdr  [MOLEX_KK_10_HDR]
U4  MPU-9250  [Quad24]

### Nets
3V3: C20.1 C21.1 H5.1 H5.9 U4.1(RESV_VDDIO) U4.8(VDDIO) U4.13(VDD) U4.22(nCS)
GND: C20.2 C21.2 C22.2 H5.2 H5.7 H5.10 U4.9(AD0/SDO) U4.11(FSYNC) U4.18(GND) U4.20(RESV_GND)
INT_IMU: H5.8 U4.12(INT)
SCL: H5.3 U4.23(SCL/SCLK)
SDA: H5.4 U4.24(SDA/SDI)
NetC22_1: C22.1 U4.10(REGOUT)

Not connected (* = marked no-connect by the designer): H5 5* 6*; U4 7(AUX_CL)* 21(AUX_DA)*

### Notes on the sheet
- IMU
- Title
- Drawn by:
- Date:
- Time:
- Revision:
- Sheet
- of
- File:

### Library data of the parts
C20 C22 = CC_100nF_0603: CAP CER 100nF X7R +-10% 50V 0603; PackageReference: 0603; Code_IPC: 1608 [0603]; Verify: *; Supplier: ECE Dept; Storage Location: PCB Assembly WS; Value: 100nF
C21 = CC_10nF_0603: CAP CER 10nF X7R +-10% 50V 0603; PackageReference: 0603; Code_IPC: 1608 [0603]; Verify: *; Supplier: ECE Dept; Storage Location: PCB Assembly WS; Value: 10nF
H5 = JA_MOLEX_KK_10POS: CONN HEADER 10POS 2.54mm VERT_ Thru Hole; Supplier 1: Farnell; Supplier Part Number 1: 1756828; Supplier: ECE Dept; Storage Location: ECE Dept Store; Value: 10 Pin Molex KK Hdr
U4 = MPU-9250: 9 axis IMU

## Sheet Radio.SchDoc: Radio
size A3; DrawnBy: Hank Wu, Connor Kwon; Address1: ECE Department; Address2: University of Canterbury; Address3: Christchurch 8041; Address4: New Zealand; Revision: 1
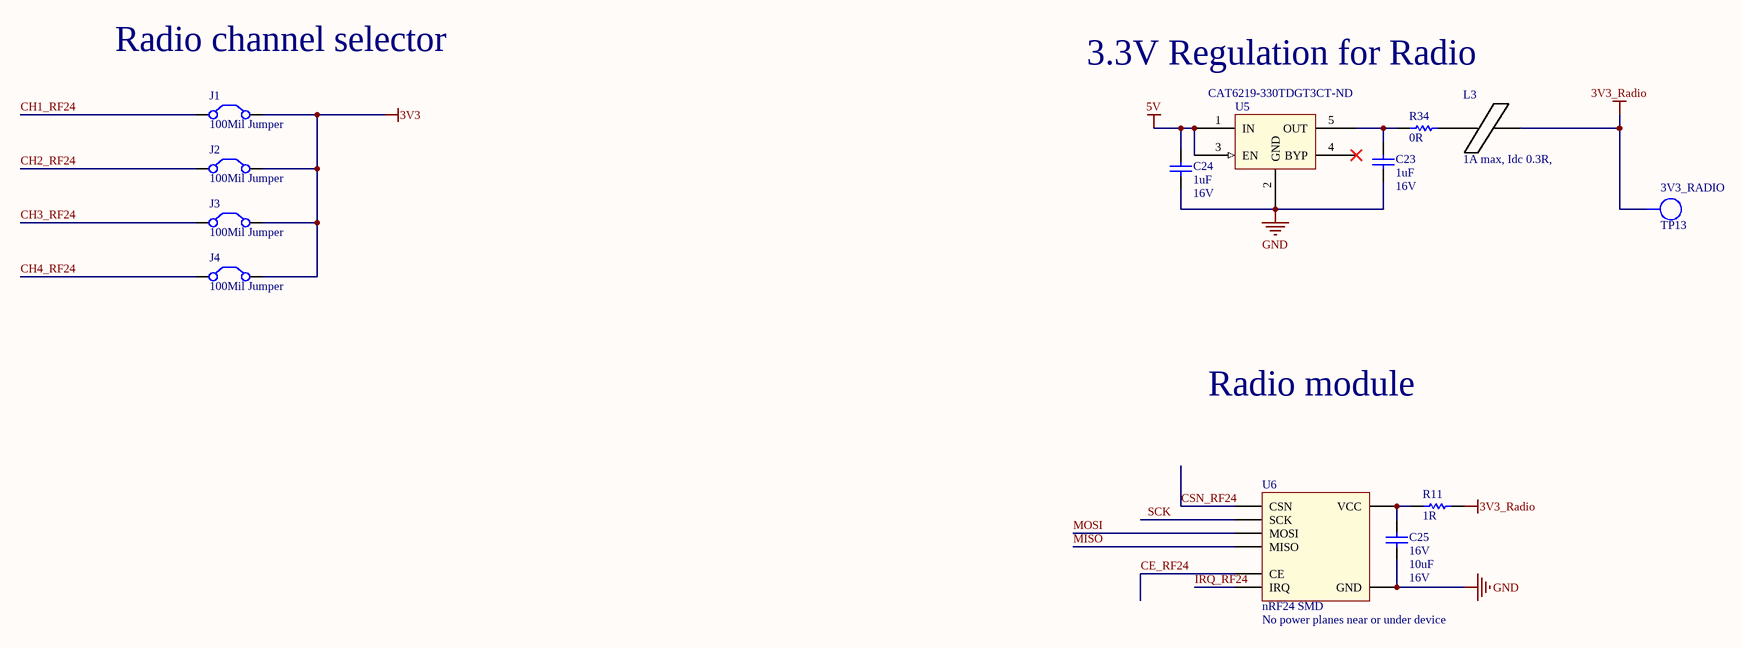
[diagram p3: Radio.SchDoc]

### Parts
C23  Max Voltage: 16V  [CAPC1608L]  (hidden comment: 1uF)
C24  Max Voltage: 16V  [CAPC1608L]  (hidden comment: 1uF)
C25  Voltage - Rated: 16V  [CAPC2012L]  (hidden comment: 10uF)
J1  100Mil Jumper  [JMP2.54]
J2  100Mil Jumper  [JMP2.54]
J3  100Mil Jumper  [JMP2.54]
J4  100Mil Jumper  [JMP2.54]
L3  1A max, Idc 0.3R,  [INDC3216L]
R11  1R  [RESC3216L]
R34  0R  [RESC1608L]
TP13  3V3_RADIO  [TP_1206]  (no BOM)
U5  Supplier Part Number: CAT6219-330TDGT3CT-ND  [SOT95P280X145-5N]  (hidden comment: CAT6219-330TDGT3)
U6  nRF24 SMD  Warning: No power planes near or under device  [NRF24]

### Nets
3V3: J1.2(C2) J2.2(C2) J3.2(C2) J4.2(C2)
3V3_Radio: L3.2 R11.2 TP13.1
5V: C24.2 U5.1(IN) U5.3(EN)
GND: C23.1 C24.1 C25.1 U5.2(GND) U6.2(GND)
CE_RF24: U6.3(CE)
CH1_RF24: J1.1(C1)
CH2_RF24: J2.1(C1)
CH3_RF24: J3.1(C1)
CH4_RF24: J4.1(C1)
CSN_RF24: U6.4(CSN)
IRQ_RF24: U6.8(IRQ)
MISO: U6.7(MISO)
MOSI: U6.6(MOSI)
SCK: U6.5(SCK)
NetC23_2: C23.2 R34.1 U5.5(OUT)
NetC25_2: C25.2 R11.1 U6.1(VCC)
NetL3_1: L3.1 R34.2

Not connected (* = marked no-connect by the designer): U5 4(BYP)*

### Notes on the sheet
- Radio channel selector
- 3.3V Regulation for Radio
- Radio module
- Title
- Drawn by:
- Date:
- Time:
- Revision:
- Sheet
- of
- File:

### Library data of the parts
C23 C24 = CC_1uF_0603: CAP CER 1uF Y5V -20% +80% 16V 0603; PackageReference: 0603; Code_IPC: 1608 [0603]; Verify: *; Supplier: ECE Dept; Storage Location: PCB Assembly WS; Value: 1uF
C25 = CC_10uF_16V_0805: as C17 on sheet Power; PackageReference: 0805; Code_IPC: 2012[0805]; Supplier 1: Digi-Key; RoHS: RoHS Compliant; Category: Capacitors; Stock 1: 20000; Pricing 1: 1=0.35, 10=0.25, 100=0.1178, 500=0.08254, 1000=0.06831 (NZD); Packaging: Cut Tape (CT); Part Status: Active; Temperature Coefficient: X5R; Operating Temperature: -55°C ~ 85°C; Features: -; Ratings: -; Applications: General Purpose; Mounting Type: Surface Mount, MLCC; Package / Case: 0805 (2012 Metric); Size / Dimension: 0.079" L x 0.049" W (2.00mm x 1.25mm); Height - Seated (Max): -; Thickness (Max): 0.055" (1.40mm); Lead Spacing: -; Lead Style: -; ComponentLink1URL: http://www.samsungsem.com/kr/support/product-search/mlcc/CL21A106KOQNNWE.jsp; ComponentLink1Description: http://www.samsungsem.com/kr/support/product-search/mlcc/CL21A106KOQNNWE.jsp; Supplier Part Number 1: 1276-2894-1-ND; Value: 10uF; Max Voltage: 16V
J1-J4 = TP_JUMPER: 2.54mm Jumper Thru Hole; Pitch Spacing: 2.54; No. of Rows: 1; No. of Positions: 2; Supplier: ECE Dept; Supplier 1: Farnell; Supplier Part Number 1: 1097975; Storage Location: ECE$ Store
L3 = IN_Ferrite-Bead: as L1 on sheet MCU; Supplier: ECE Dept; Storage Location: PCB Assembly WS; Ferrite Mounting: SMD; Supplier 1: Farnell; Supplier Part Number 1: 1612060; Manufacturer Part Number: 2512066017Y1; Value: 1A max, Idc 0.3R,
R11 = RT_1R: RES 1R OHM 1/4W 5% 1206 SMD; Storage Location: PCB Assembly WS; Supplier: ECE Dept; Value: 1R
R34 = RS_0R0: RES 0.0 OHM 1/10W 5% 0603 SMD; Storage Location: PCB Assembly WS; Supplier: ECE Dept; Value: 0R
TP13 = TP_1206: as TP1 on sheet MCU; Manufacturer PN: *; Storage Location: ProtoPlace; Mounting Type: Surface Mount; Type: PC Test Point; Supplier 1: Digi-Key; Supplier Part Number 1: 952-1478-2-ND; Supplier 2: Farnell; Supplier Part Number 2: 1826282; Supplier: ECE Dept
U5 = SV_CAT6219-330TDGT3: as U2 on sheet MCU; Manufacturer Part Number: CAT6219-330TDGT3; Base Part Number: CAT6219; Current - Output: 500mA; Package / Case: SOT-23-5 Thin, TSOT-23-5; Supplier: Digi-Key; Supplier Device Package: TSOT-23-5; Voltage - Output (Min/Fixed): 3.3V; ComponentLink1URL: http://www.onsemi.com/pub/Collateral/CAT6219-D.PDF; ComponentLink1Description: http://www.onsemi.com/pub/Collateral/CAT6219-D.PDF; Supplier 1: Digi-Key
U6 = NRF24: nRF24 SMD Module

## Sheet buzzer.SchDoc: Buzzer
size A3; DrawnBy: Connor Kwon; Address1: ECE Department; Address2: University of Canterbury; Address3: Christchurch 8041; Address4: New Zealand; Revision: 1
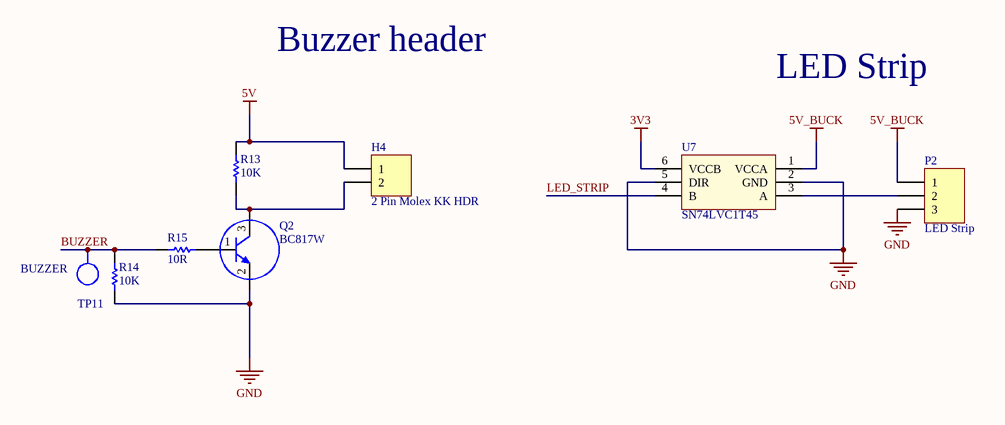
[diagram p4: buzzer.SchDoc]

### Parts
H4  2 Pin Molex KK HDR  [MOLEX_KK_2_HDR]
P2  LED Strip  [MHDR1X3]
Q2  BC817W  [SOT323_M]
R13  10K  [RESC1608L]
R14  10K  [RESC1608L]
R15  10R  [RESC1608L]
TP11  BUZZER  [TP_1206]  (no BOM)
U7  SN74LVC1T45  [SOT23-6_N]

### Nets
3V3: U7.6(VCCB)
5V: H4.1 R13.2
5V_BUCK: P2.1 U7.1(VCCA)
GND: P2.3 Q2.2 R14.1 U7.2(GND) U7.5(DIR)
BUZZER: R14.2 R15.1 TP11.1
LED_STRIP: U7.4(B)
NetH4_2: H4.2 Q2.3 R13.1
NetP2_2: P2.2 U7.3(A)
NetQ2_1: Q2.1 R15.2

### Notes on the sheet
- Buzzer header
- LED Strip
- Title
- Drawn by:
- Date:
- Time:
- Revision:
- Sheet
- of
- File:

### Library data of the parts
H4 = JA_MOLEX_KK_2POS: CONN HEADER 2POS 2.54mm VERT_Thru Hole; Supplier 1: Farnell; Supplier Part Number 1: 1462926; Supplier: ECE Dept; Storage Location: ECE Dept Store; Value: 2 Pin Molex KK HDR
P2 = MHDR1X3: Header, 3-Pin; LatestRevisionDate: 17-Jul-2002; LatestRevisionNote: Re-released for DXP Platform.; Publisher: Altium Limited
Q2 = TB_BC817W: NPN GP Bipolar Transistor 45V 500mA SOT323; Manufacturer: NXP; Supplier 1: Farnell; Supplier Part Number 1: 2114873; Manufacturer PN: BC817W; Storage Location: PCB Assembly WS; Supplier: ECE Dept; Value: BC817W
R13 R14 = RS_10K: RES 10.0K OHM 1/10W 5% 0603 SMD; Storage Location: PCB Assembly WS; Supplier: ECE Dept; Value: 10K
R15 = RS_10R: RES 10 OHM 1/10W 5% 0603 SMD; Storage Location: PCB Assembly WS; Supplier: ECE Dept; Value: 10R
TP11 = TP_1206: as TP1 on sheet MCU; Manufacturer PN: *; Storage Location: ProtoPlace; Mounting Type: Surface Mount; Type: PC Test Point; Supplier 1: Digi-Key; Supplier Part Number 1: 952-1478-2-ND; Supplier 2: Farnell; Supplier Part Number 2: 1826282; Supplier: ECE Dept
U7 = SN74LVC1T45: 1.8V - 5V level converter

## Sheet joystick.SchDoc: Joystick
size A3; DrawnBy: Hank Wu, Connor Kwon; Address1: ECE Department; Address2: University of Canterbury; Address3: Christchurch 8041; Address4: New Zealand; Revision: 1
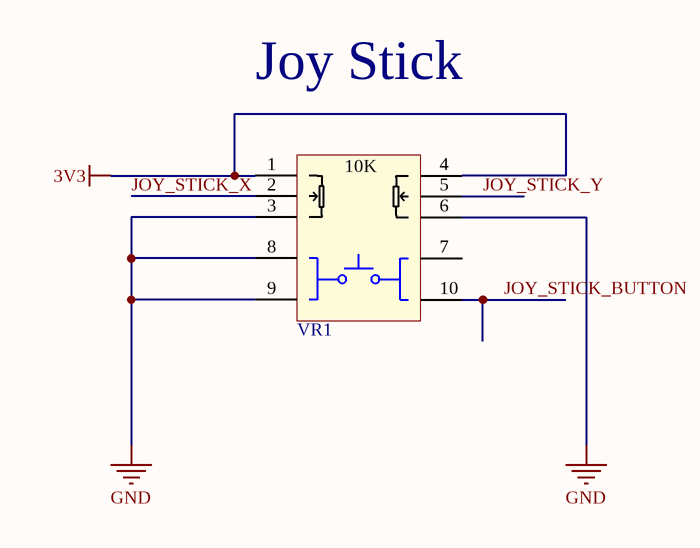
[diagram p5: joystick.SchDoc]

### Parts
VR1  Joystick 10k with Sw  [Joystick_Sw]  (value not drawn)

### Nets
3V3: VR1.1 VR1.4(1')
GND: VR1.3 VR1.6(3') VR1.8 VR1.9
JOY_STICK_BUTTON: VR1.10
JOY_STICK_X: VR1.2
JOY_STICK_Y: VR1.5(2')

Not connected (* = marked no-connect by the designer): VR1 7

### Notes on the sheet
- Joy Stick
- Title
- Drawn by:
- Date:
- Time:
- Revision:
- Sheet
- of
- File:
- (in symbol Joystick 10k with Sw) 10K

### Library data of the parts
VR1 = Joystick 10k with Sw: JOYSTICK 10K OHM 2 AXIS TH; Manufacturer 1: SparkFun; Manufacturer Part Number 1: COM-09032; Supplier 1: Digi-Key; Stock 1: 563; Pricing 1: 1=3.95000 (USD); RoHS: No; ComponentLink1URL: https://media.digikey.com/pdf/Data%20Sheets/Sparkfun%20PDFs/COM-09032_Web.pdf?src-supplier=Digi-Key; ComponentLink1Description: https://media.digikey.com/pdf/Data%20Sheets/Sparkfun%20PDFs/COM-09032_Web.pdf?src-supplier=Digi-Key; Supplier Part Number 1: 1568-1526-ND

## Nets that join several sheets
3V3: MCU (18 pins), IMU (8 pins), Radio (J1.2 J2.2 J3.2 J4.2), buzzer (U7.6), joystick (VR1.1 VR1.4)
5V: MCU (C1.2 TP5.1 U2.1 U2.3), Power (D2.2 D3.2), Radio (C24.2 U5.1 U5.3), buzzer (H4.1 R13.2)
5V_BUCK: Power (D3.1 R12.2), buzzer (P2.1 U7.1)
GND: MCU (40 pins), Power (12 pins), IMU (10 pins), Radio (5 pins), buzzer (5 pins), joystick (VR1.3 VR1.6 VR1.8 VR1.9)
VBUS: MCU (C16.2 H1.1 R3.2 TP7.1), Power (R31.1)
BAT_VOLTAGE: MCU (U1.16), Power (C26.2 R20.2 R32.1)
BUZZER: MCU (U1.33), buzzer (R14.2 R15.1 TP11.1)
CE_RF24: MCU (U1.26), Radio (U6.3)
CH1_RF24: MCU (U1.52), Radio (J1.1)
CH2_RF24: MCU (U1.42), Radio (J2.1)
CH3_RF24: MCU (U1.41), Radio (J3.1)
CH4_RF24: MCU (U1.38), Radio (J4.1)
CSN_RF24: MCU (U1.25), Radio (U6.4)
INT_IMU: MCU (U1.37), IMU (H5.8 U4.12)
IRQ_RF24: MCU (U1.21), Radio (U6.8)
JOY_STICK_BUTTON: MCU (U1.13), joystick (VR1.10)
JOY_STICK_X: MCU (U1.10), joystick (VR1.2)
JOY_STICK_Y: MCU (U1.9), joystick (VR1.5)
LED_STRIP: MCU (U1.29), buzzer (U7.4)
MISO: MCU (U1.27), Radio (U6.7)
MOSI: MCU (U1.22), Radio (U6.6)
SCK: MCU (U1.23), Radio (U6.5)
SCL: MCU (R9.1 U1.36), IMU (H5.3 U4.23)
SDA: MCU (R10.1 U1.43), IMU (H5.4 U4.24)